# EAGLE design displayconnector (EAGLE 6.4)
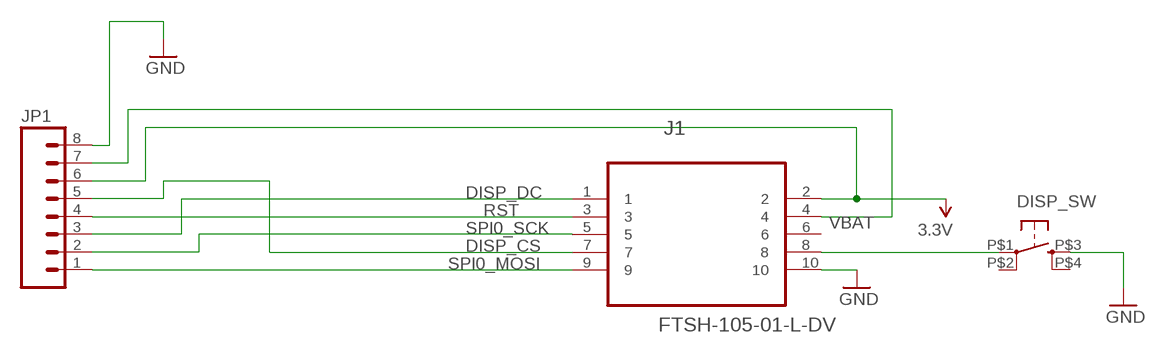
[diagram p0: schematic, sheet 1]

## Parts
DISP_SW  TAC_SWITCHKSA_SEALED  [KSA_SEALED_TAC_SWITCH]
J1  FTSH-105-01-L-DV  [SAMTEC_FTSH-105-01-L-DV]
JP1  M08LOCK_LONGPADS  [1X08_LOCK_LONGPADS]

## Nets
3.3V: J1.2 JP1.6
DISP_CS: J1.7 JP1.5
DISP_DC: J1.1 JP1.3
DISP_SW: DISP_SW.P$1 J1.8
GND: DISP_SW.P$3 J1.10 JP1.8
RST: J1.3 JP1.4
SPI0_MOSI: J1.9 JP1.1
SPI0_SCK: J1.5 JP1.2
VBAT: J1.4 JP1.7
Unconnected: DISP_SW.P$2 DISP_SW.P$4 J1.6

## Library data of the parts
DISP_SW = SparkFun-Electromechanical:TAC_SWITCH: Momentary Switch Button commonly used for reset or general input. Spark Fun Electronics SKU : COM-00097 SMT- SWCH-08247
J1 = SAMTEC-HTSW-FTxx_By_element14_Batch_1:FTSH-105-01-L-DV: CONN HEADER, 1.27MM, 2X5WAY, SMT; MPN: FTSH-105-01-L-DV; OC_FARNELL: 1667759; OC_NEWARK: 11P4814; PACKAGE: HEADER, 1.27MM, 2X5WAY, SMT; SUPPLIER: SAMTEC
JP1 = SparkFun-Connectors:M08: Header 8 Standard 8-pin 0.1" header. Use with straight break away headers (SKU : PRT-00116), right angle break away headers (PRT-00553), swiss pins (PRT-00743), machine pins (PRT-00117), and female headers (PRT-00115).

## Board
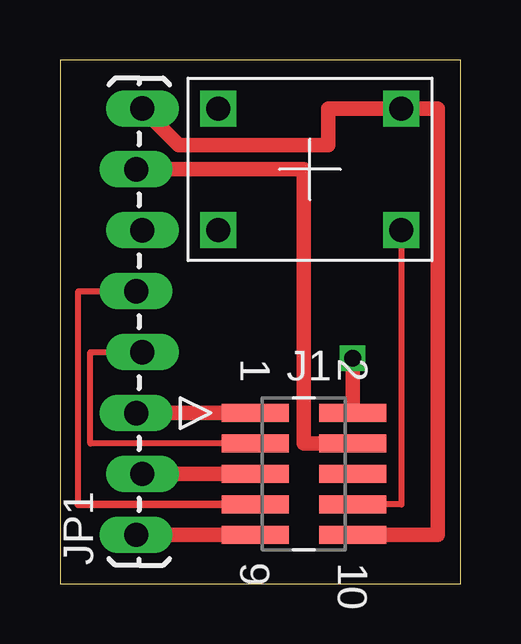
[diagram p1: board, top side]
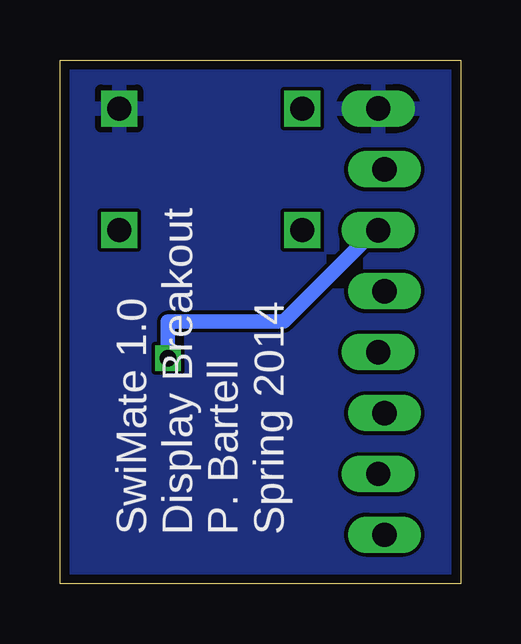
[diagram p2: board, bottom side, seen from below]

Size 16.69 x 21.83 mm. Coordinates in mm from the lower left corner, seen from the top.
Outline: 0,0 16.69,0 16.69,21.83 0,21.83 0,0
Copper layers (1*16): Top 0.0356mm / dielectric 1.5011mm / Bottom 0.0356mm
Design rules "LaenPCBOrder": minimum track width 6mil, minimum drill 13mil, track to track 6mil, track to pad 6mil, pad to pad 6mil, via to via 6mil, smd to smd 6mil, copper to edge 15mil, drill to drill 6mil, minimum pad ring 7mil, minimum via ring 7mil, stop-mask expansion 3mil, vias tented up to drill 0mil, thermal gap 10mil

### Footprints (pad centres in the part's own frame; a part is rotated, then mirrored left to right if it is on the bottom)
KSA_SEALED_TAC_SWITCH = drill 1 square: P$1 -3.81,2.54; P$2 3.81,2.54; P$3 -3.81,-2.54; P$4 3.81,-2.54
SAMTEC_FTSH-105-01-L-DV = smd 0.762 x 2.794: 1 -2.54,-2.032; 2 -2.54,2.032; 3 -1.27,-2.032; 4 -1.27,2.032; 5 0,-2.032; 6 0,2.032; 7 1.27,-2.032; 8 1.27,2.032; 9 2.54,-2.032; 10 2.54,2.032
1X08_LOCK_LONGPADS = drill 1.016 long: 1 0,0.127; 2 2.54,-0.127; 3 5.08,0.127; 4 7.62,-0.127; 5 10.16,0.127; 6 12.7,-0.127; 7 15.24,0.127; 8 17.78,-0.127

### Placement (x,y rotation side)
DISP_SW  10.41,17.27 180 top
J1  10.16,4.57 270 top
JP1  3.3,2.03 90 top

### Tracks (layer width: path | path; a pad name or v marks a point on that pad's centre or on a via)
3.3V  (via drill 0.7)
  Top 0.61: v12.19,9.4 J1.2
  Bottom 0.61: JP1.6 3.56,14.73 7.37,10.92 12.19,10.92 v12.19,9.4
DISP_CS
  Top 0.254: 0.76,3.3 0.76,12.19 JP1.5
  Top 0.305: J1.7 0.76,3.3
DISP_DC
  Top 0.61: J1.1 JP1.3
DISP_SW
  Top 0.254: DISP_SW.P$1 14.22,3.3 J1.8
GND
  Top 0.61: J1.10 15.75,2.03 15.75,19.81 DISP_SW.P$3 11.18,19.81 11.18,18.29 4.95,18.29 JP1.8
  pour Bottom: 0.51,0.25 16,0.25 16,21.59 0.51,21.59 0.51,20.83
RST
  Top 0.254: J1.3 1.27,5.84 1.27,9.65 JP1.4
SPI0_MOSI
  Top 0.61: JP1.1 J1.9
SPI0_SCK
  Top 0.61: JP1.2 J1.5
VBAT
  Top 0.61: JP1.7 10.16,17.27 10.16,5.84 J1.4

### Text on the board
_bsilk: SwiMate 1.0 / Display Breakout / P. Bartell / Spring 2014